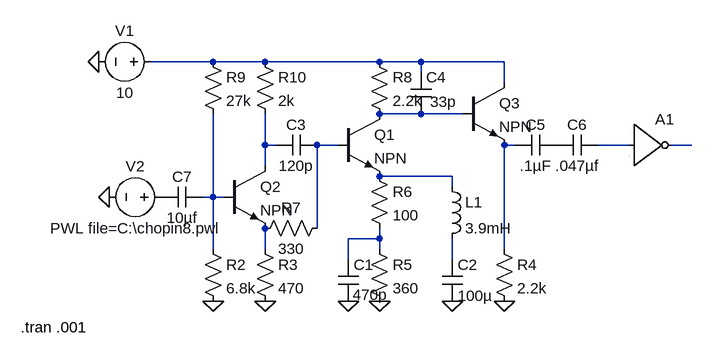
[diagram p0: schematic cld1010-efm.asc]
cld1010-efm.asc, the LTspice schematic file:
Version 4
SHEET 1 1960 680
WIRE 112 -48 16 -48
WIRE 192 -48 112 -48
WIRE 368 -48 192 -48
WIRE 432 -48 368 -48
WIRE 560 -48 432 -48
WIRE 432 -32 432 -48
WIRE 560 -16 560 -48
WIRE 432 32 368 32
WIRE 496 32 432 32
WIRE 192 80 192 32
WIRE 208 80 192 80
WIRE 304 80 272 80
WIRE 576 80 560 80
WIRE 752 80 704 80
WIRE 848 80 816 80
WIRE 192 112 192 80
WIRE 480 128 368 128
WIRE 480 144 480 128
WIRE 112 160 112 32
WIRE 112 160 96 160
WIRE 128 160 112 160
WIRE 272 208 272 80
WIRE 368 224 368 208
WIRE 368 224 320 224
WIRE 112 240 112 160
WIRE 192 240 192 208
WIRE 368 240 368 224
WIRE 560 240 560 80
WIRE 320 256 320 224
WIRE 480 256 480 224
FLAG -64 -48 0
FLAG -48 160 0
FLAG 112 320 0
FLAG 192 320 0
FLAG 320 320 0
FLAG 368 320 0
FLAG 480 320 0
FLAG 560 320 0
SYMBOL cap 96 144 R90
WINDOW 0 0 32 VBottom 2
WINDOW 3 32 32 VTop 2
SYMATTR InstName C7
SYMATTR Value 10µf
SYMBOL voltage 32 -48 R90
WINDOW 0 -32 56 VBottom 2
WINDOW 3 32 56 VTop 2
SYMATTR InstName V1
SYMATTR Value 10
SYMBOL voltage 48 160 R90
WINDOW 0 -32 56 VBottom 2
WINDOW 3 32 56 VTop 2
WINDOW 123 0 0 Left 2
WINDOW 39 0 0 Left 2
SYMATTR InstName V2
SYMATTR Value PWL file=C:\chopin8.pwl
SYMBOL res 96 224 R0
SYMATTR InstName R2
SYMATTR Value 6.8k
SYMBOL res 176 224 R0
SYMATTR InstName R3
SYMATTR Value 470
SYMBOL res 544 224 R0
SYMATTR InstName R4
SYMATTR Value 2.2k
SYMBOL res 352 224 R0
SYMATTR InstName R5
SYMATTR Value 360
SYMBOL cap 304 256 R0
WINDOW 3 23 54 Left 2
SYMATTR Value 470p
SYMATTR InstName C1
SYMBOL cap 464 256 R0
SYMATTR InstName C2
SYMATTR Value 100µ
SYMBOL res 352 112 R0
SYMATTR InstName R6
SYMATTR Value 100
SYMBOL ind 464 128 R0
SYMATTR InstName L1
SYMATTR Value 3.9mH
SYMBOL res 288 192 R90
WINDOW 0 0 56 VBottom 2
WINDOW 3 32 56 VTop 2
SYMATTR InstName R7
SYMATTR Value 330
SYMBOL npn 304 32 R0
SYMATTR InstName Q1
SYMBOL cap 272 64 R90
WINDOW 0 0 32 VBottom 2
WINDOW 3 32 32 VTop 2
SYMATTR InstName C3
SYMATTR Value 120p
SYMBOL npn 128 112 R0
SYMATTR InstName Q2
SYMBOL res 352 -64 R0
SYMATTR InstName R8
SYMATTR Value 2.2k
SYMBOL cap 416 -32 R0
WINDOW 3 30 45 Left 2
SYMATTR Value 33p
SYMATTR InstName C4
SYMBOL npn 496 -16 R0
SYMATTR InstName Q3
SYMBOL cap 640 64 R90
WINDOW 0 0 32 VBottom 2
WINDOW 3 32 32 VTop 2
SYMATTR InstName C5
SYMATTR Value .1µF
SYMBOL res 96 -64 R0
SYMATTR InstName R9
SYMATTR Value 27k
SYMBOL res 176 -64 R0
SYMATTR InstName R10
SYMATTR Value 2k
SYMBOL cap 704 64 R90
WINDOW 0 0 32 VBottom 2
WINDOW 3 32 32 VTop 2
SYMATTR InstName C6
SYMATTR Value .047µf
SYMBOL Digital\\inv 752 16 R0
SYMATTR InstName A1
TEXT -184 360 Left 2 !.tran .001

The netlist it stands for:
* cld1010-efm.asc
C7 N009 P001 10µf
V1 N001 0 10
V2 P001 0 PWL file=C:\chopin8.pwl
R2 N009 0 6.8k
R3 N011 0 470
R4 N005 0 2.2k
R5 N010 0 360
C1 N010 0 470p
C2 N012 0 100µ
R6 N008 N010 100
L1 N008 N012 3.9mH
R7 N004 N011 330
Q1 N002 N004 N008 0 NPN
C3 N004 N003 120p
Q2 N003 N009 N011 0 NPN
R8 N001 N002 2.2k
C4 N001 N002 33p
Q3 N001 N002 N005 0 NPN
C5 P002 N005 .1µF
R9 N001 N009 27k
R10 N001 N003 2k
C6 N006 P002 .047µf
A1 N006 0 0 0 0 N007 0 0 BUF
.model NPN NPN
.model PNP PNP
.lib standard.bjt
.tran .001
.backanno
.end